# Altium schematic sheet Sheet1.SchDoc
size A4 portrait
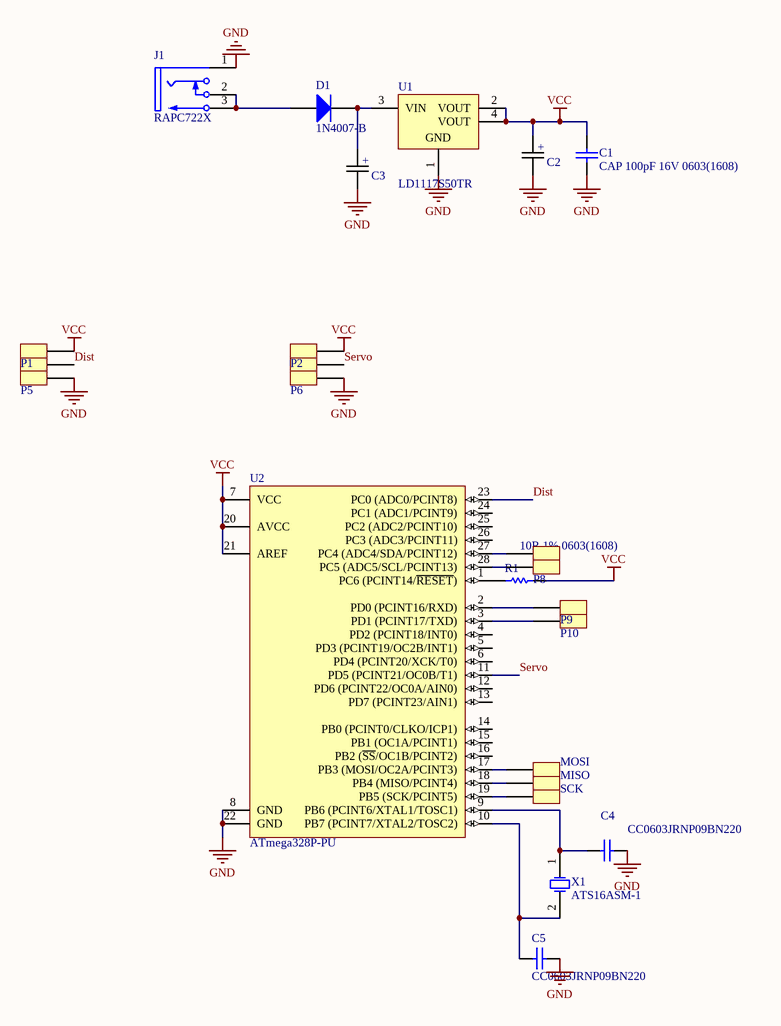
[diagram p0: Sheet1.SchDoc]

## Parts
C1  CAP 100pF 16V 0603(1608)  [CAPC0603(1608)100_L]
C2  (no value)  [CAP_EEFK_K16]
C3  (no value)  [CAP_EEFK_K16]
C4  CC0603JRNP09BN220  [CAPC1608X90X40ML10T20]
C5  CC0603JRNP09BN220  [CAPC1608X90X40ML10T20]
D1  1N4007-B  [DIOD-DO-41-P-2_V]
J1  RAPC722X  [SWITCH-RAPC712X-3_V]
MISO  Pin 100mil  [Pin 100mil]  (value not drawn)
MOSI  Pin 100mil  [Pin 100mil]  (value not drawn)
P1  Pin 100mil  [Pin 100mil]  (value not drawn)
P2  Pin 100mil  [Pin 100mil]  (value not drawn)
P3  Pin 100mil  [Pin 100mil]  (value not drawn)
P4  Pin 100mil  [Pin 100mil]  (value not drawn)
P5  Pin 100mil  [Pin 100mil]  (value not drawn)
P6  Pin 100mil  [Pin 100mil]  (value not drawn)
P7  Pin 100mil  [Pin 100mil]  (value not drawn)
P8  Pin 100mil  [Pin 100mil]  (value not drawn)
P9  Pin 100mil  [Pin 100mil]  (value not drawn)
P10  Pin 100mil  [Pin 100mil]  (value not drawn)
R1  10R 1% 0603(1608)  [RESC0603(1608)_L]
SCK  Pin 100mil  [Pin 100mil]  (value not drawn)
U1  LD1117S50TR  [SOT-223_L]
U2  ATmega328P-PU  [28P3]
X1  ATS16ASM-1  [CTS-ATS-SM-XTAL-2]

## Nets
GND: C1.1 C2.- C3.- C4.2 C5.2 J1.1 P5.0 P6.0 U1.1(GND) U2.8(GND) U2.22(GND)
VCC: C1.2 C2.+ P1.0 P2.0 R1.2 U1.2(VOUT) U1.4(VOUT) U2.7(VCC) U2.20(AVCC) U2.21(AREF)
Dist: P3.0 U2.23(PC0_(ADC0/PCINT8))
Servo: P4.0 U2.11(PD5_(PCINT21/OC0B/T1))
NetC3_+: C3.+ D1.2(K) U1.3(VIN)
NetC4_1: C4.1 U2.9(PB6_(PCINT6/XTAL1/TOSC1)) X1.1(X1)
NetC5_1: C5.1 U2.10(PB7_(PCINT7/XTAL2/TOSC2)) X1.2(X2)
NetD1_1: D1.1(A) J1.2 J1.3
NetMISO_0: MISO.0 U2.18(PB4_(MISO/PCINT4))
NetMOSI_0: MOSI.0 U2.17(PB3_(MOSI/OC2A/PCINT3))
NetP7_0: P7.0 U2.27(PC4_(ADC4/SDA/PCINT12))
NetP8_0: P8.0 U2.28(PC5_(ADC5/SCL/PCINT13))
NetP9_0: P9.0 U2.2(PD0_(PCINT16/RXD))
NetP10_0: P10.0 U2.3(PD1_(PCINT17/TXD))
NetR1_1: R1.1 U2.1(PC6_(PCINT14/~{RESET}))
NetSCK_0: SCK.0 U2.19(PB5_(SCK/PCINT5))

Not connected (* = marked no-connect by the designer): U2 4(PD2_(PCINT18/INT0)) 5(PD3_(PCINT19/OC2B/INT1)) 6(PD4_(PCINT20/XCK/T0)) 12(PD6_(PCINT22/OC0A/AIN0)) 13(PD7_(PCINT23/AIN1)) 14(PB0_(PCINT0/CLKO/ICP1)) 15(PB1_(OC1A/PCINT1)) 16(PB2_(~{SS}/OC1B/PCINT2)) 24(PC1_(ADC1/PCINT9)) 25(PC2_(ADC2/PCINT10)) 26(PC3_(ADC3/PCINT11))

## Notes on the sheet
- Title
- Size:
- Date:
- A4
- Number:
- Time:
- Revision:
- Sheet
- of
- File:

## Library data of the parts
C1 = CMP-1035-01259-1: CAP 100pF 16V ±5% 0603 (1608 Metric) Thickness 1mm SMD; Tolerance: Â±5%; Case-EIA: 0603; Case-Metric: 1608; Value: 100pF; Max Thickness: 1 mm; Rated Voltage: 16 V; Technology: SMT
C2 C3 = CAP: pin to pad: +>1 ->2
C4 C5 = CMP-1659-00006-3: Chip Capacitor, 22 pF, +/- 5%, 50 V, -55 to 125 degC, 0603 (1608 Metric), RoHS, Tape and Reel; Mount: Surface Mount; PackageReference: 0603; DatasheetVersion: Rev. 13, 05/2016; RoHSCompliant: true; PackageDescription: 2-Pin Surface Mount Device, Body 1.6 x 0.8 mm; Min Operating Temperature: -55 degC; Length: 1.6 mm; Mounting Technology: Surface Mount; Max Operating Temperature: 125 degC
D1 = CMP-0639-00010-2: 1.0 A Rectifier, 8 pF, 1000 V, -65 to 150 degC, 2-Pin DO-41 Plastic, RoHS, Bulk; Manufacturer: Diodes Inc; CT (pF): 8; VRRM (V): 1000; Max. Average Rectified Current IO (A): 1; Max. IR (uA): 5; Max. IFSM (A): 30; Packing: Bulk; Mounting Technology: Through Hole; PackageDescription: 2-Pin Axial Lead, Body 4.635 x 2.36 mm, Lead Spread 25.4 mm; Operating Temperature Range (degC): -65 to 150; ComponentLink1Description: Manufacturer URL; DatasheetVersion: Rev. 8-2; ComponentLink1URL: http://diodes.com/; ComponentLink2Description: Datasheet; PartNumber: 1N4007-B; ComponentLink2URL: http://diodes.com/datasheets/ds28002.pdf; RoHS: TRUE; PackageReference: DO-41-P-2; VF (V): 1
J1 = CMP-2000-05384-1: Power Jack, 5 A, 3-Pin THD, RoHS, Bulk; Manufacturer: Switchcraft; Current Rating: 5A; Plug/Mating Plug Diameter: 2.1mmID,5.5mmOD; Gender: Male; Mating Products: S765-ND / -CONNPLUGMINIPWR2CONDWHT/RED / S760K-ND / -CONNPOWERPLUGMINI.08"BLACK / SC1052-ND / -CONNPOWERPLUGMINIBLACK; Number of Positions/Contacts: 2Conductors,2Contacts; Internal Switch(s): SingleSwitch,NormallyClosed; Shielding: Unshielded; Catalog Drawings: RAPC7(1,2)2XSide / RAPC7(1,2)2XTop; Dynamic Catalog: SwitchcraftInc; Other Names: Q2287470A / RAPC722X-ND / SC1313; Standard Package: 2,500; Termination: SolderEyelet(s); Family: Barrel-PowerConnectors; Housing Color: Black; Housing Material: Thermoplastic; RoHS Information: SwitchcraftRoHSInfo; Color: Black; Contact Material - Plating: Nickel; Mounting Type: ThroughHole,RightAngle; Manufacturer URL: http://www.switchcraft.com/; Contact Material: Brass; Datasheet Version: Rev. A, 08/2005; Connector Type: Jack; Category: Connectors,Interconnects; Datasheet URL: http://www.mouser.com/ds/2/393/rapc722x_cd-371352.pdf
MISO MOSI P1-P10 SCK = 1-Pin
R1 = CMP-1012-00284-1: 10R 0.1W 1% 0603 (1608 Metric)  SMD; Case-Metric: 1608; Case-EIA: 0603; Value: 10.00 Ohm; Tolerance: 1 %; Power: 0.1 W; Technology: SMT
U1 = CMP-0244-00312-1: Fixed Low Drop Positive Voltage Regulator, 5V, 4-Pin SOT-223, Tape and Reel; ComponentLink1URL: http://www.st.com; DatasheetVersion: 1/11/2011; PackageDescription: 4-Pin SOT-223 Package, 6.5 x 3.5 mm Body, 2.3 mm Pitch, 7 mm Lead Span; ComponentLink2URL: http://www.st.com/internet/com/TECHNICAL_RESOURCES/TECHNICAL_LITERATURE/DATASHEET/CD00000544.pdf; ComponentLink1Description: Manufacturer URL; PackageReference: SOT-223; PackageVersion: 2010; ComponentLink2Description: Datasheet
U2 = CMP-0095-00013-2: 8-bit AVR Microcontroller, 32KB Flash, 1KB EEPROM, 2KB SRAM, 28-pin PDIP, Industrial Grade (-40°C to 85°C); RevisionNote: DatasheetVersion updated. URLs added.; PackageVersion: revB, Sep-2001; PackageDescription: 28-lead (0.300"/7.62mm Wide) Plastic Dual Inline Package (PDIP); DatasheetVersion: revD, May-2011; ComponentLink1Description: Manufacturer URL; ComponentLink1URL: http://www.atmel.com/; PackageReference: 28P3; ComponentLink2Description: ATmega48A/48PA/88A/88PA/168A/168PA/328/328P Datasheet; ComponentLink3URL: http://www.atmel.com/dyn/resources/prod_documents/8271S.pdf; ComponentLink2URL: http://www.atmel.com/dyn/resources/prod_documents/8271.pdf; ComponentLink3Description: ATmega48A/48PA/88A/88PA/168A/168PA/328/328P Summary
X1 = CMP-0585-00002-2: ATS-SM Series Quartz Crystal, 16 MHz, -20 to 70 degC, 11.1 x 4.83 x 4.3mm SMD, RoHS, Tape and Reel; Manufacturer: CTS Corporation; Shunt Capacitance (C0): 7.0 pF Max; Frequency: 16 MHz; Oscillation Mode: Fundamental or 3rd Overtone; Crystal Cut: AT-Cut; ESR Maximum: 40 Ohms; Drive Level (Type): 100 uW; PackageDescription: 2-Pin SMD, Body 11.1 x 4.83 mm, Pitch 8.5 mm; PackageReference: ATS-SM-XTAL-2; ComponentLink1URL: http://www.ctscorp.com/; PartNumber: ATS16ASM-1; RoHS: TRUE; ComponentLink1Description: Manufacturer URL; Operating Temperature: -20 to 70 degC; DatasheetVersion: Rev. K; ComponentLink2Description: Datasheet; Packing: Tape and Reel; ComponentLink2URL: http://www.ctscorp.com/components/Datasheets/008-0309-0.pdf; Mounting Technology: Surface Mount; ComponentLink3URL: http://www.ctscorp.com/components/Datasheets/008-0309-0.pdf; ComponentLink3Description: Package Specification